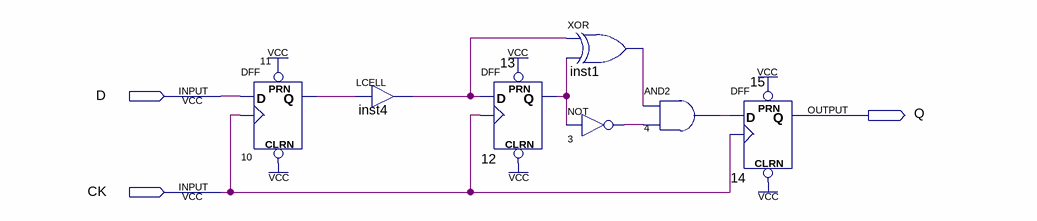
[diagram p0: schematic sheet]
// Quartus schematic pedge_s.bdf as structural Verilog: 7 symbols, 3 pins
module pedge_s (
  input  D,
  input  CK,
  output Q
);

  wire inst1_out, inst4_out, n3_out, n4_out, n10_q, n12_q;

  DFF u_10 (.CLRN(1'b1), .CLK(CK), .D(D), .PRN(1'b1), .Q(n10_q));
  LCELL inst4 (.IN(n10_q), .OUT(inst4_out));
  DFF u_12 (.CLRN(1'b1), .CLK(CK), .D(inst4_out), .PRN(1'b1), .Q(n12_q));
  xor inst1 (inst1_out, inst4_out, n12_q);
  not u_3 (n3_out, n12_q);
  and u_4 (n4_out, inst1_out, n3_out);
  DFF u_14 (.CLRN(1'b1), .CLK(CK), .D(n4_out), .PRN(1'b1), .Q(Q));
endmodule
